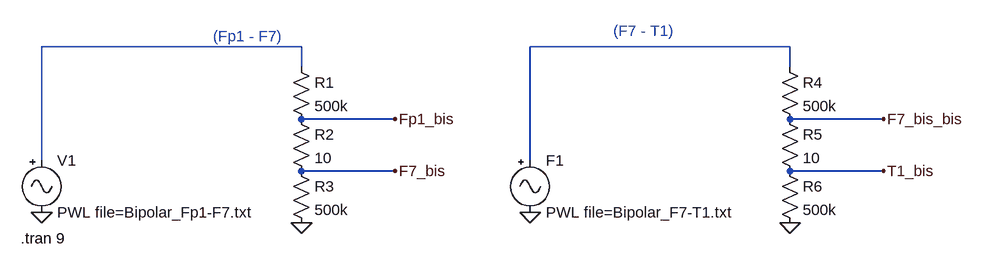
[diagram p0: schematic Teoria1_test.asc]
Teoria1_test.asc, the LTspice schematic file:
Version 4
SHEET 1 1360 680
WIRE 320 0 -80 0
WIRE 1072 0 672 0
WIRE 320 32 320 0
WIRE 1072 32 1072 0
WIRE 464 112 320 112
WIRE 1216 112 1072 112
WIRE -80 176 -80 0
WIRE 672 176 672 0
WIRE 464 192 320 192
WIRE 1216 192 1072 192
FLAG -80 256 0
FLAG 320 272 0
FLAG 464 112 Fp1_bis
FLAG 464 192 F7_bis
FLAG 672 256 0
FLAG 1072 272 0
FLAG 1216 112 F7_bis_bis
FLAG 1216 192 T1_bis
SYMBOL Misc\\signal -80 160 R0
WINDOW 123 0 0 Left 0
WINDOW 39 0 0 Left 0
WINDOW 3 24 96 Left 2
SYMATTR Value PWL file=Bipolar_Fp1-F7.txt
SYMATTR InstName V1
SYMBOL res 304 16 R0
SYMATTR InstName R1
SYMATTR Value 500k
SYMBOL res 304 96 R0
SYMATTR InstName R2
SYMATTR Value 10
SYMBOL res 304 176 R0
SYMATTR InstName R3
SYMATTR Value 500k
SYMBOL Misc\\signal 672 160 R0
WINDOW 123 0 0 Left 0
WINDOW 39 0 0 Left 0
WINDOW 3 24 96 Left 2
SYMATTR Value PWL file=Bipolar_F7-T1.txt
SYMATTR InstName F1
SYMBOL res 1056 16 R0
SYMATTR InstName R4
SYMATTR Value 500k
SYMBOL res 1056 96 R0
SYMATTR InstName R5
SYMATTR Value 10
SYMBOL res 1056 176 R0
SYMATTR InstName R6
SYMATTR Value 500k
TEXT 184 -16 Left 2 ;(Fp1 - F7)
TEXT -112 296 Left 2 !.tran 9
TEXT 800 -24 Left 2 ;(F7 - T1)

The netlist it stands for:
* Teoria1_test.asc
V1 N001 0 PWL file=Bipolar_Fp1-F7.txt
R1 N001 Fp1_bis 500k
R2 Fp1_bis F7_bis 10
R3 F7_bis 0 500k
V§F1 N002 0 PWL file=Bipolar_F7-T1.txt
R4 N002 F7_bis_bis 500k
R5 F7_bis_bis T1_bis 10
R6 T1_bis 0 500k
* (Fp1 - F7)
.tran 9
* (F7 - T1)
.backanno
.end

* Results of the author's LTspice run, read from the files saved beside the schematic
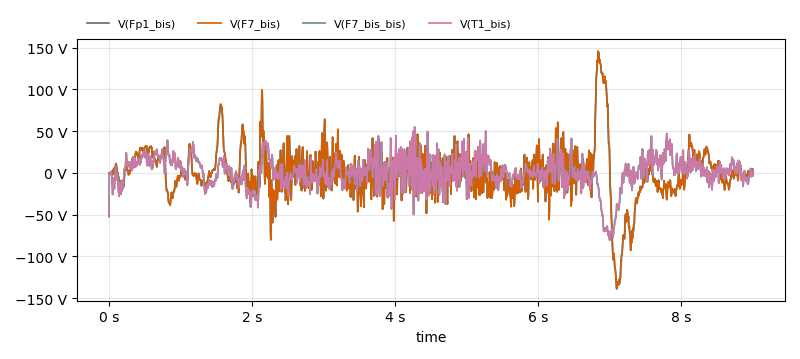
[diagram p1: Transient Analysis of Teoria1_test.asc, plotted from the saved traces]
* Transient Analysis, 1 run:
*   V(Fp1_bis): min -138.8 V, max 145.8 V, average 239.2 mV, rms 31.06 V, last -2.051 V
*   V(F7_bis): min -138.8 V, max 145.8 V, average 239.2 mV, rms 31.06 V, last -2.051 V
*   V(F7_bis_bis): min -80.39 V, max 54.99 V, average 427.3 mV, rms 17.99 V, last -3.614 V
*   V(T1_bis): min -80.39 V, max 54.99 V, average 427.2 mV, rms 17.98 V, last -3.614 V